# EAGLE schematic HeaderBoard2.2 (EAGLE 9.1.3)
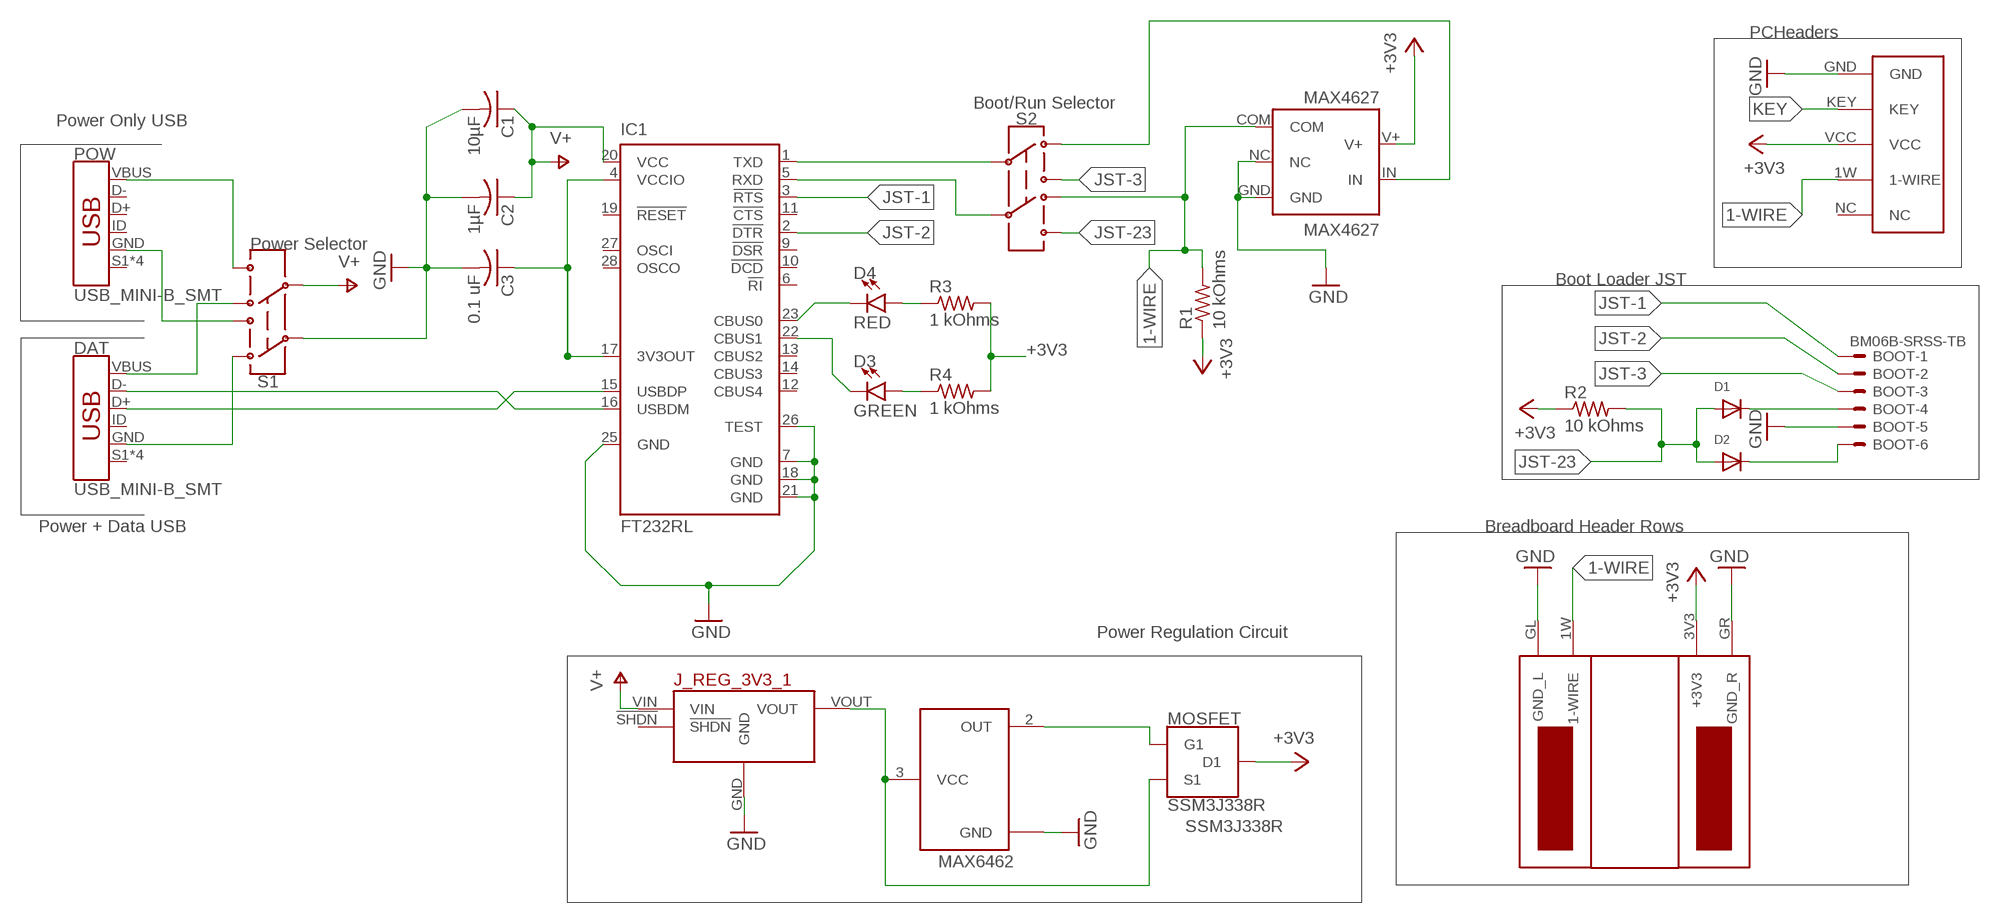
[diagram p0: schematic, sheet 1]

## Parts
BOOT  BM06B-SRSS-TB  [BM06B-SRSS-TB]
C1  10µF  C-USC0805  [C0805]
C2  1µF  C-USC0805  [C0805]
C3  0.1 uF  C-USC0805  [C0805]
D1  DIODESOD-123  [SOD-123]
D2  DIODESOD-123  [SOD-123]
D3  GREEN  LED-GREEN0603  [LED-0603]
D4  RED  LED-RED0603  [LED-0603]
DAT  USB_MINI-B_SMT  [USB-MINIB]
IC1  FT232RL  [SSOP28]
J_REG_3V3_1  3V3_VOLTAGE_REGULATOR  [3V3_VOLTAGE_REGULATOR]
MAX4627  MAX4627  [MAX4627]
MAX6462  MAX6461  [SC70-3L]
MOSFET  SSM3J338R  [SOT23]
POW  USB_MINI-B_SMT  [USB-MINIB]
R1  10 kOhms  R-US_R0603  [R0603]
R2  10 kOhms  R-US_R0603  [R0603]
R3  1 kOhms  R-US_R0603  [R0603]
R4  1 kOhms  R-US_R0603  [R0603]
S1  SWITCH-DPDT-SMD-AYZ0202  [SWITCH_DPDT_SMD_AYZ0202]
S2  SWITCH-DPDT-SMD-AYZ0202  [SWITCH_DPDT_SMD_AYZ0202]
U$3  BBHEADERPINS_5R  [BBHEADERPINS_5R]
U$4  PCBOARD_PINS  [PCBOARD_PINS]

## Nets
1-WIRE: MAX4627.COM R1.2 S2.4 U$3.1W(1-WIRE) U$4.1W(1-WIRE)
+3V3: MAX4627.V+ MOSFET.D(D1) R1.1 R2.1 R3.2 R4.2 U$3.3V3(+3V3) U$4.VCC
GND: BOOT.5 C1.2 C2.2 C3.2 IC1.7(GND) IC1.18(GND) IC1.21(GND) IC1.25(GND) IC1.26(TEST) J_REG_3V3_1.GND MAX4627.GND MAX4627.NC MAX6462.1(GND) S1.2 U$3.GL(GND_L) U$3.GR(GND_R) U$4.GND
JST-1: BOOT.1 IC1.3(!RTS)
JST-2: BOOT.2 IC1.2(!DTR)
JST-3: BOOT.3 S2.3
JST-23: D1.A D2.A R2.2 S2.6
KEY: U$4.KEY
N$1: D3.C IC1.22(CBUS1)
N$2: IC1.1(TXD) S2.2
N$3: IC1.5(RXD) S2.5
N$4: BOOT.6 D2.C
N$5: DAT.VBUS S1.4
N$6: DAT.GND S1.1
N$7: POW.GND S1.3
N$8: POW.VBUS S1.6
N$9: BOOT.4 D1.C
N$10: MAX4627.IN S2.1
N$11: J_REG_3V3_1.VOUT MAX6462.3(VCC) MOSFET.S(S1)
N$12: MAX6462.2(OUT) MOSFET.G(G1)
N$14: DAT.D+ IC1.15(USBDP)
N$15: DAT.D- IC1.16(USBDM)
N$16: C3.1 IC1.4(VCCIO) IC1.17(3V3OUT)
N$17: D3.A R4.1
N$18: D4.A R3.1
N$21: D4.C IC1.23(CBUS0)
V+: C1.1 C2.1 IC1.20(VCC) J_REG_3V3_1.VIN S1.5
Unconnected: DAT.ID DAT.S1(SHIELD) DAT.S2(SHIELD) DAT.S3(SHIELD) DAT.S4(SHIELD) IC1.6(!RI) IC1.9(!DSR) IC1.10(!DCD) IC1.11(!CTS) IC1.12(CBUS4) IC1.13(CBUS2) IC1.14(CBUS3) IC1.19(!RESET) IC1.27(OSCI) IC1.28(OSCO) J_REG_3V3_1.!SHDN! POW.D+ POW.D- POW.ID POW.S1(SHIELD) POW.S2(SHIELD) POW.S3(SHIELD) POW.S4(SHIELD) U$4.NC

## Notes on the sheet
- PCHeaders
- Boot/Run Selector
- Power Only USB
- Power Selector
- Boot Loader JST
- Power + Data USB | Breadboard Header Rows
- Power Regulation Circuit
- SSM3J338R
- MAX6462

## Library data of the parts
BOOT = con-jst2:?M06B-SRSS-TB: Disconnectable Crimp style connector, 1.0mm pitch 6 contacts
C1-C3 = rcl:C-US: CAPACITOR, American symbol
D1 D2 = adafruit:DIODE: Diode SMADIODE - SMA Surface Mount Package 20V 1A Schottky Diode Digikey: 641-1014-6-ND DO-1N4148 - Through Hole Small Current Diode SOD-123 20V 1 A (.5mV Vf) Schottky Diode - Digikey: MBRX120TPMSCT-ND SOD-323 10V 570mA (.38mV Vf, 3ns) Schottky Diode - Digikey: ZLLS410CT-ND SOD-523 30V 30mA Schottky Diode (RB751S-40TE61) - Digikey: RB751S-40TE61CT-ND SOT23-R/W - SOT23 Package (R = Solder Paste/Reflow Ovens, W = Hand-Soldering) BAT54Film 40V 300mA - Digikey: 497-7162-1-ND
D3 = SparkFun-LED:LED-GREEN: Green SMD LED Used in manufacturing of various products at SparkFun Packages: 0603 - SMD 0603 package [Product Link] <http://www.futureelectronics.com/en/technologies/semiconductors/optoelectronics/leds/Pages/9894312-LTST-C190GKT.aspx?CrossPart=HSMG-C190&IM=0> LilyPad 1206 - SMD1206 LilyPad package [Product Link] <http://www.futureelectronics.com/en/Technologies/Product.aspx?ProductID=IN150NGHARVATEKCORPORATION2049943&IM=0> 1206 - SMD1206 package [Product Link] <http://www.futureelectronics.com/en/technologies/semiconductors/optoelectronics/leds/Pages/8315665-LTST-C150KGKT.aspx?IM=0> 1206 Bottom Mount -SMD 1206 Bottom Mount [Product Link] <http://www.digikey.com/product-detail/en/lite-on-inc/LTST-C230KGKT/160-1456-1-ND/386854> SparkFun Products: Pro Mini 328 -5V <https://www.sparkfun.com/products/821> RedBoard <https://www.sparkfun.com/products/12757> MP3 Trigger <https://www.sparkfun.com/products/13720> Makey Makey <https://www.sparkfun.com/products/11076>; PROD_ID: DIO-00821
D4 = SparkFun-LED:LED-RED: Red SMD LED Used in manufacturing of most products at SparkFun Packages: 0603 - SMD 0603 package [Product Link] <http://docs.avagotech.com/docs/AV02-0551EN> 0603 SMART - SMD 0603 SMART package ( more efficient and expensive)[Product Link] <http://www.osram-os.com/Graphics/XPic2/00077099_0.pdf> 1206 - SMD1206 package [Product Link] <https://www.sparkfun.com/datasheets/DevTools/LilyPad/Q150OVS4.pdff> SparkFun Products: Pro Mini 328 -5V <https://www.sparkfun.com/products/821> RedBoard <https://www.sparkfun.com/products/12757> IOIO-OTG <https://www.sparkfun.com/products/13613>; PROD_ID: DIO-00819
DAT POW = SparkFun-Connectors:USB_MINI-B: USB type Mini-B Connector Breaks out 5th pin, and includes shield pins if needed. SparkFun Products: SparkFun FTDI Basic Breakout <https://www.sparkfun.com/products/9716> SparkFun XBee Explorer USB <https://www.sparkfun.com/products/11812> SparkFun Redboard <https://www.sparkfun.com/products/12757>; PROD_ID: CONN-08193; SF_ID: PRT-00587
IC1 = ftdichip:FT232R: Source: http://www.ftdichip.com/Documents/DataSheets/DS_FT232R_v104.pdf; MPN: FT232RL; OC_FARNELL: 1146032; OC_NEWARK: 91K9918
J_REG_3V3_1 = Pololu Voltage Regulators:3V3_VOLTAGE_REGULATOR: Polulu 3V3 Step-Up/Step-Down Voltage Regulator S7V8F3
MAX4627 = lbym:MAX4627
MAX6462 = maxim:MAX6461
MOSFET = lbym:SSM3J338R
R1-R4 = rcl:R-US_: RESISTOR, American symbol
S1 S2 = SparkFun-Switches:SWITCH-DPDT: Double-Pole, Double-Throw (DPDT) Switch Double-pole, double-throw switches. Variant Overview PTH-GPI-152-3013 Used on SparkFun Geiger Counter <https://www.sparkfun.com/products/11345> SMD-AY0202 Surface Mount DPDT Switch <https://www.sparkfun.com/products/597> (COM-00597) Used on e.g. LilyPad Arduino USB - ATmega32U4 Board <https://www.sparkfun.com/products/12049>; PROD_ID: SWCH-08179; SF_SKU: COM-00597
U$3 = lbym:BBHEADERPINS_5R
U$4 = lbym:PCBOARD_PINS